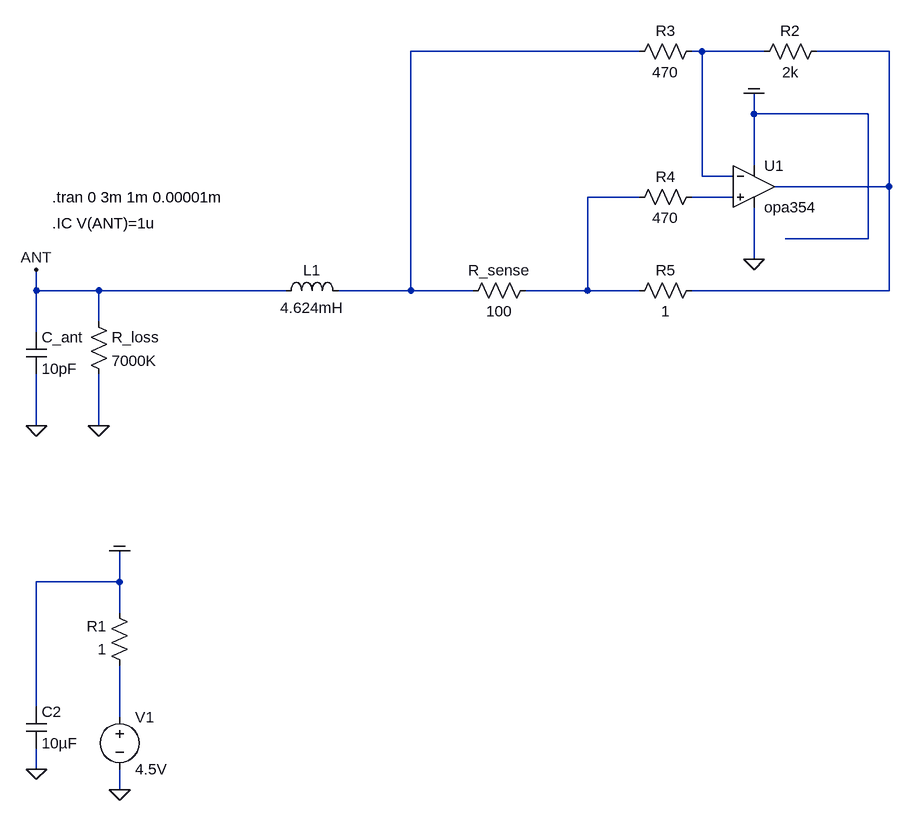
[diagram p0: schematic 2020_current_sense_lt6200_v02.asc]
2020_current_sense_lt6200_v02.asc, the LTspice schematic file:
Version 4
SHEET 1 3920 3748
WIRE 96 112 -256 112
WIRE 192 112 176 112
WIRE 288 112 192 112
WIRE 480 112 368 112
WIRE 272 208 272 176
WIRE 448 208 272 208
WIRE 272 288 272 208
WIRE 192 304 192 112
WIRE 240 304 192 304
WIRE 480 320 480 112
WIRE 480 320 304 320
WIRE 96 336 16 336
WIRE 240 336 176 336
WIRE 448 400 448 208
WIRE 448 400 320 400
WIRE 272 432 272 352
WIRE -832 480 -832 448
WIRE -736 480 -832 480
WIRE -448 480 -736 480
WIRE -256 480 -256 112
WIRE -256 480 -368 480
WIRE -160 480 -256 480
WIRE 16 480 16 336
WIRE 16 480 -80 480
WIRE 96 480 16 480
WIRE 480 480 480 320
WIRE 480 480 176 480
WIRE -736 528 -736 480
WIRE -832 544 -832 480
WIRE -832 688 -832 608
WIRE -736 688 -736 608
WIRE -704 928 -704 880
WIRE -704 928 -832 928
WIRE -704 976 -704 928
WIRE -832 1120 -832 928
WIRE -704 1136 -704 1056
WIRE -832 1216 -832 1184
WIRE -704 1248 -704 1216
FLAG -704 1248 0
FLAG -704 880 COM
FLAG -832 688 0
FLAG -832 448 ANT
FLAG -736 688 0
FLAG -832 1216 0
FLAG 272 176 COM
FLAG 272 432 0
SYMBOL voltage -704 1120 R0
WINDOW 123 0 0 Left 0
WINDOW 39 0 0 Left 0
SYMATTR InstName V1
SYMATTR Value 4.5V
SYMBOL ind -464 496 R270
WINDOW 0 32 56 VTop 2
WINDOW 3 5 56 VBottom 2
SYMATTR InstName L1
SYMATTR Value 4.624mH
SYMATTR SpiceLine Rser=120 Rpar=100Meg Cpar=1.216pF
SYMBOL cap -848 544 R0
SYMATTR InstName C_ant
SYMATTR Value 10pF
SYMBOL res -752 512 R0
SYMATTR InstName R_loss
SYMATTR Value 7000K
SYMBOL res -64 464 R90
WINDOW 0 0 56 VBottom 2
WINDOW 3 32 56 VTop 2
SYMATTR InstName R_sense
SYMATTR Value 100
SYMBOL res -688 1072 R180
WINDOW 0 36 76 Left 2
WINDOW 3 36 40 Left 2
SYMATTR InstName R1
SYMATTR Value 1
SYMBOL cap -848 1120 R0
SYMATTR InstName C2
SYMATTR Value 10µF
SYMBOL res 272 128 R270
WINDOW 0 32 56 VTop 2
WINDOW 3 0 56 VBottom 2
SYMATTR InstName R2
SYMATTR Value 2k
SYMBOL res 80 128 R270
WINDOW 0 32 56 VTop 2
WINDOW 3 0 56 VBottom 2
SYMATTR InstName R3
SYMATTR Value 470
SYMBOL res 80 352 R270
WINDOW 0 32 56 VTop 2
WINDOW 3 0 56 VBottom 2
SYMATTR InstName R4
SYMATTR Value 470
SYMBOL res 80 496 R270
WINDOW 0 32 56 VTop 2
WINDOW 3 0 56 VBottom 2
SYMATTR InstName R5
SYMATTR Value 1
SYMBOL SBORKA\\OPamp\\opa354 272 320 R0
SYMATTR InstName U1
TEXT -808 336 Left 2 !.tran 0 3m 1m 0.00001m
TEXT -808 376 Left 2 !.IC V(ANT)=1u

The netlist it stands for:
* 2020_current_sense_lt6200_v02.asc
V1 N006 0 4.5V
L1 ANT N001 4.624mH Rser=120 Rpar=100Meg Cpar=1.216pF
C_ant ANT 0 10pF
R_loss ANT 0 7000K
R_sense N004 N001 100
R1 N006 COM 1
C2 COM 0 10µF
R2 N002 N003 2k
R3 N001 N002 470
R4 N004 N005 470
R5 N004 N003 1
* U1: opa354 (symbol SBORKA\OPamp\opa354 not available, pins judged from their places): In+=N005 In-=N002 V+=COM V-=0 OUT=N003
.tran 0 3m 1m 0.00001m
.IC V(ANT)=1u
.backanno
.end